# Altium schematic sheet 汇总.SchDoc
size A4
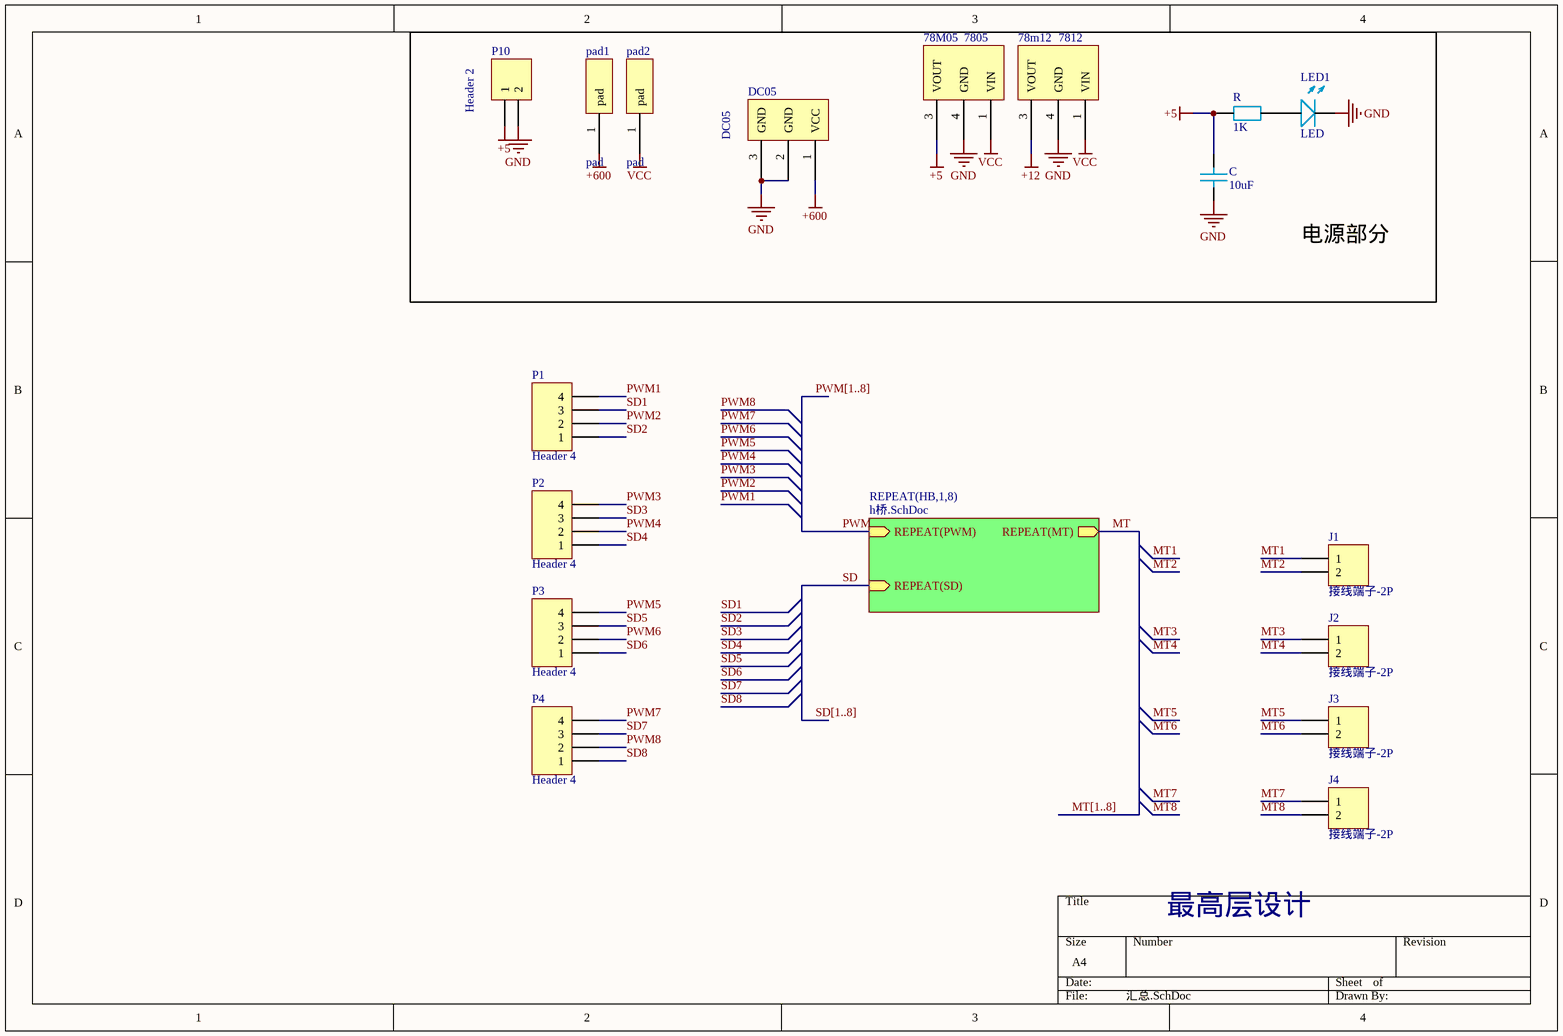
[diagram p0: 汇总.SchDoc]

## Parts
78M05  7805  [78M05]
78m12  7812  [78M05]
C  10uF  [0805_C]
DC05  DC05  [DC-005 - duplicate]
J1  接线端子-2P  [KF128-5.08-2P]
J2  接线端子-2P  [KF128-5.08-2P]
J3  接线端子-2P  [KF128-5.08-2P]
J4  接线端子-2P  [KF128-5.08-2P]
LED1  LED  [LED_0805]
P1  Header 4  [MX 1.25-WS-4P]
P2  Header 4  [MX 1.25-WS-4P]
P3  Header 4  [MX 1.25-WS-4P]
P4  Header 4  [MX 1.25-WS-4P]
P10  Header 2  [HDR1X2]
pad1  pad  [PAD3*3]
pad2  pad  [PAD3*3]
R  1K  [0805_R]

## Blocks framed on the sheet
电源部分: 78M05 78m12 C DC05 LED1 P10 pad1 pad2 R

## Sub-sheets
REPEAT(HB,1,8) = h桥.SchDoc: REPEAT(PWM) (in), REPEAT(SD) (in), REPEAT(MT) (out)

## Nets
+5: 78M05.3(VOUT) C.1 P10.1 R.1
+12: 78m12.3(VOUT)
+600: DC05.1(VCC) pad1.1(pad)
GND: 78M05.4(GND) 78m12.4(GND) C.2 DC05.2(GND) DC05.3(GND) LED1.2 P10.2
VCC: 78M05.1(VIN) 78m12.1(VIN) pad2.1(pad)
MT: sheet REPEAT(HB,1,8)/REPEAT(MT)
MT1: J1.1
MT2: J1.2
MT3: J2.1
MT4: J2.2
MT5: J3.1
MT6: J3.2
MT7: J4.1
MT8: J4.2
PWM: sheet REPEAT(HB,1,8)/REPEAT(PWM)
PWM1: P1.4
PWM2: P1.2
PWM3: P2.4
PWM4: P2.2
PWM5: P3.4
PWM6: P3.2
PWM7: P4.4
PWM8: P4.2
SD: sheet REPEAT(HB,1,8)/REPEAT(SD)
SD1: P1.3
SD2: P1.1
SD3: P2.3
SD4: P2.1
SD5: P3.3
SD6: P3.1
SD7: P4.3
SD8: P4.1
NetLED1_1: LED1.1 R.2

## Buses and harness runs
bus MT[1..8]
bus PWM[1..8]
bus SD[1..8]

## Notes on the sheet
- 最高层设计

## Library data of the parts
78m12 = 7805
C = C
DC05 = DC05: DC05电源
J1-J4 = 接线端子-2P: 通用接线端子
P1-P4 = Header 4: Header, 4-Pin; LatestRevisionDate: 17-Jul-2002; LatestRevisionNote: Re-released for DXP Platform.; Publisher: Altium Limited
P10 = Header 2: Header, 2-Pin; LatestRevisionDate: 17-Jul-2002; LatestRevisionNote: Re-released for DXP Platform.; Publisher: Altium Limited
pad1 pad2 = pad1
R = R